# Altium project gps_power.PrjPcb
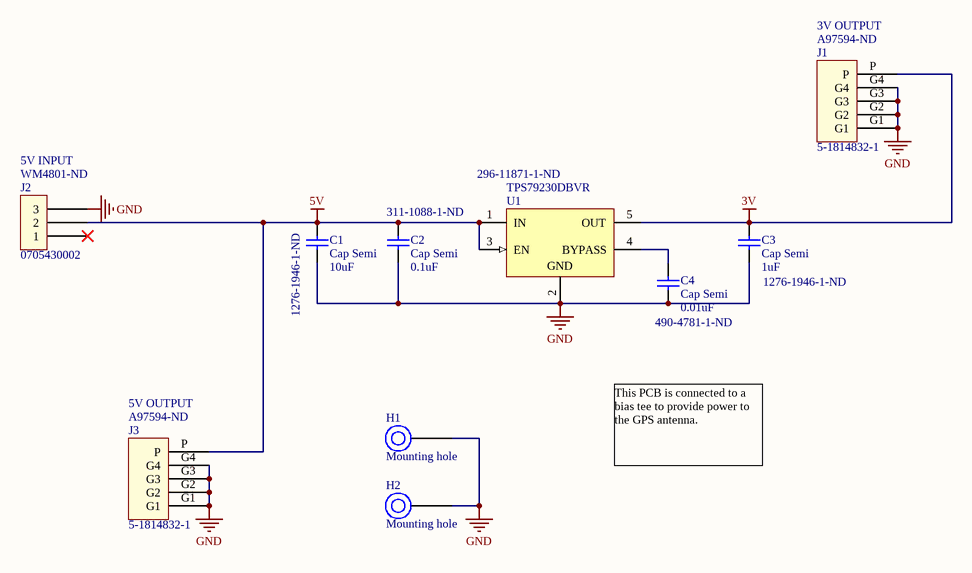
[diagram p0: power-1.SchDoc]
1 sheet, 10 parts. Net scope: global (net labels, ports and power ports of the same name join across sheets).
Board file: gps_power.PcbDoc

## Sheet power-1.SchDoc
size A

### Parts
C1  Cap Semi  value 10uF  Supplier Part Number 1: 1276-1946-1-ND  [1608[0603]]
C2  Cap Semi  value 0.1uF  Supplier Part Number 1: 311-1088-1-ND  [1608[0603]]
C3  Cap Semi  value 1uF  Supplier Part Number 1: 1276-1946-1-ND  [1608[0603]]
C4  Cap Semi  value 0.01uF  Supplier Part Number 1: 490-4781-1-ND  [1608[0603]]
H1  Mounting hole  [M3 hole]  (no BOM)
H2  Mounting hole  [M3 hole]  (no BOM)
J1  5-1814832-1  Supplier Part Number 1: A97594-ND  [5-1814832-1]
J2  0705430002  Supplier Part Number 1: WM4801-ND  [0705430002]
J3  5-1814832-1  Supplier Part Number 1: A97594-ND  [5-1814832-1]
U1  TPS79230DBVR  Supplier Part Number 1: 296-11871-1-ND  [DBV0005A_L]

### Nets
3V: C3.2 J1.P U1.5(OUT)
5V: C1.2 C2.2 J2.2 J3.P U1.1(IN) U1.3(EN)
GND: C1.1 C2.1 C3.1 C4.1 H1.1 H2.1 J1.G1 J1.G2 J1.G3 J1.G4 J2.3 J3.G1 J3.G2 J3.G3 J3.G4 U1.2(GND)
NetC4_2: C4.2 U1.4(BYPASS)

Not connected (* = marked no-connect by the designer): J2 1*

### Notes on the sheet
- (near J1) 3V OUTPUT
- (near J2) 5V INPUT
- (near J3) 5V OUTPUT
- This PCB is connected to a bias tee to provide power to the GPS antenna.

### Library data of the parts
C1 = Cap Semi: Capacitor (Semiconductor SIM Model); Manufacturer: Samsung; Manufacturer Part Number: CL10B105KP8NNNC; Capacitance: 1uF; Tolerance: 10%; Voltage Rating: 10V; Dielectric: X7R; Published: 8-Jun-2000; LatestRevisionDate: 29-May-2009; LatestRevisionNote: IPC-7351 Footprint Added.; PackageReference: C1206; Publisher: Altium Limited; PackageDescription: Chip Capacitor; Supplier 1: Digi-Key; Stock 1: 10370961; RoHS: Yes; Mount: Surface Mount; Case/Package: 0603; Case Code (Metric): 1608; Case Code (Imperial): 0603; Contact Plating: Tin; Min Operating Temperature: -55°C; Max Operating Temperature: 125°C; Package Quantity: 1; Packaging: Tape and Reel; Voltage Rating (DC): 10V; Length: 1.6mm; Height: 0.8mm; Width: 0.031inch; Thickness: 0.035inch; Depth: 0.8mm; Radiation Hardening: No; Lead Free: Lead Free; ComponentLink1URL: https://datasheet.ciiva.com/25788/cl10b105kp8nnnc-25788304.pdf?src-supplier=Digi-Key; ComponentLink1Description: https://datasheet.ciiva.com/25788/cl10b105kp8nnnc-25788304.pdf?src-supplier=Digi-Key; ComponentLink2URL: https://datasheet.ciiva.com/16396/cl10b105kp8nnnc-16396970.pdf?src-supplier=Future+Electronics; ComponentLink2Description: https://datasheet.ciiva.com/16396/cl10b105kp8nnnc-16396970.pdf?src-supplier=Future+Electronics; ComponentLink3URL: https://datasheet.ciiva.com/26838/getdatasheetpartid-358410-26838426.pdf?src-supplier=Verical; ComponentLink3Description: https://datasheet.ciiva.com/26838/getdatasheetpartid-358410-26838426.pdf?src-supplier=Verical
C2 = Cap Semi: Capacitor (Semiconductor SIM Model); Manufacturer: Yageo; Manufacturer Part Number: CC0603KRX7R7BB104; Material: Ceramic; Voltage Rating: 16V; Tolerance: 10%; Capacitance: 100nF; Dielectric: X7R; Insulation Resistance: 100GR; Published: 8-Jun-2000; LatestRevisionDate: 29-May-2009; LatestRevisionNote: IPC-7351 Footprint Added.; PackageReference: C1206; Publisher: Altium Limited; PackageDescription: Chip Capacitor; Supplier 1: Digi-Key; Stock 1: 18235990; RoHS: Yes; Mount: Surface Mount; Case/Package: 0603; Number of Pins: 2; Case Code (Metric): 1608; Case Code (Imperial): 0603; Min Operating Temperature: -55°C; Max Operating Temperature: 125°C; Voltage Rating (DC): 16V; Package Quantity: 1; Packaging: Tape and Reel; Termination: SMD/SMT; Composition: Ceramic; Voltage: 16V; Length: 1.6mm; Height: 0.8mm; Width: 0.031inch; Thickness: 0.035inch; Depth: 0.8mm; Radiation Hardening: No; REACH SVHC: No SVHC; Lead Free: Lead Free; Halogen Free: Halogen Free; ComponentLink1URL: https://datasheet.ciiva.com/144/mlccorderingcode-144182.pdf?src-supplier=Digi-Key; ComponentLink1Description: https://datasheet.ciiva.com/144/mlccorderingcode-144182.pdf?src-supplier=Digi-Key; ComponentLink2URL: https://datasheet.ciiva.com/16625/upy-gphc-x7r-6-3v-to-50v-8-16625526.pdf?src-supplier=Avnet+Europe; ComponentLink2Description: https://datasheet.ciiva.com/16625/upy-gphc-x7r-6-3v-to-50v-8-16625526.pdf?src-supplier=Avnet+Europe; ComponentLink3URL: https://datasheet.ciiva.com/8033/70765-8033799.pdf?src-supplier=Element14; ComponentLink3Description: https://datasheet.ciiva.com/8033/70765-8033799.pdf?src-supplier=Element14; ComponentLink4URL: https://datasheet.ciiva.com/15165/getdatasheetpartid-63554-15165387.pdf?src-supplier=Verical; ComponentLink4Description: https://datasheet.ciiva.com/15165/getdatasheetpartid-63554-15165387.pdf?src-supplier=Verical; ComponentLink5URL: https://datasheet.ciiva.com/7978/1489800-7978141.pdf?src-supplier=Element14; ComponentLink5Description: https://datasheet.ciiva.com/7978/1489800-7978141.pdf?src-supplier=Element14; ComponentLink6URL: https://datasheet.ciiva.com/8033/1734573-8033797.pdf?src-supplier=Element14; ComponentLink6Description: https://datasheet.ciiva.com/8033/1734573-8033797.pdf?src-supplier=Element14; ComponentLink7URL: https://datasheet.ciiva.com/144/mlccorderingcode-144183.pdf?src-supplier=Digi-Key; ComponentLink7Description: https://datasheet.ciiva.com/144/mlccorderingcode-144183.pdf?src-supplier=Digi-Key; ComponentLink8URL: https://datasheet.ciiva.com/144/mlccorderingcode-144184.pdf?src-supplier=Digi-Key; ComponentLink8Description: https://datasheet.ciiva.com/144/mlccorderingcode-144184.pdf?src-supplier=Digi-Key; ComponentLink9URL: https://datasheet.ciiva.com/28450/1489800-28450552.pdf?src-supplier=Element14; ComponentLink9Description: https://datasheet.ciiva.com/28450/1489800-28450552.pdf?src-supplier=Element14; ComponentLink10URL: https://datasheet.ciiva.com/13395/upy-gphc-x7r-6-3v-to-50v-8-13395674.pdf?src-supplier=Mouser; ComponentLink10Description: https://datasheet.ciiva.com/13395/upy-gphc-x7r-6-3v-to-50v-8-13395674.pdf?src-supplier=Mouser; ComponentLink11URL: https://datasheet.ciiva.com/46430/1734573-46430156.pdf?src-supplier=Element14; ComponentLink11Description: https://datasheet.ciiva.com/46430/1734573-46430156.pdf?src-supplier=Element14
C3 = Cap Semi: Capacitor (Semiconductor SIM Model); Manufacturer: Samsung; Manufacturer Part Number: CL10B105KP8NNNC; Tolerance: 10%; Voltage Rating: 10V; Dielectric: X7R; Published: 8-Jun-2000; LatestRevisionDate: 29-May-2009; LatestRevisionNote: IPC-7351 Footprint Added.; PackageReference: C1206; Publisher: Altium Limited; PackageDescription: Chip Capacitor; Supplier 1: Digi-Key; Stock 1: 10370961; RoHS: Yes; Mount: Surface Mount; Case/Package: 0603; Case Code (Metric): 1608; Case Code (Imperial): 0603; Contact Plating: Tin; Min Operating Temperature: -55°C; Max Operating Temperature: 125°C; Package Quantity: 1; Packaging: Tape and Reel; Capacitance: 1uF; Voltage Rating (DC): 10V; Length: 1.6mm; Height: 0.8mm; Width: 0.031inch; Thickness: 0.035inch; Depth: 0.8mm; Radiation Hardening: No; Lead Free: Lead Free; ComponentLink1URL: https://datasheet.ciiva.com/25788/cl10b105kp8nnnc-25788304.pdf?src-supplier=Digi-Key; ComponentLink1Description: https://datasheet.ciiva.com/25788/cl10b105kp8nnnc-25788304.pdf?src-supplier=Digi-Key; ComponentLink2URL: https://datasheet.ciiva.com/16396/cl10b105kp8nnnc-16396970.pdf?src-supplier=Future+Electronics; ComponentLink2Description: https://datasheet.ciiva.com/16396/cl10b105kp8nnnc-16396970.pdf?src-supplier=Future+Electronics; ComponentLink3URL: https://datasheet.ciiva.com/26838/getdatasheetpartid-358410-26838426.pdf?src-supplier=Verical; ComponentLink3Description: https://datasheet.ciiva.com/26838/getdatasheetpartid-358410-26838426.pdf?src-supplier=Verical
C4 = Cap Semi: Capacitor (Semiconductor SIM Model); Manufacturer: Murata; Manufacturer Part Number: GCM188R72A103KA37D; Capacitance: 10nF; Tolerance: 10%; Voltage Rating: 100V; Dielectric: X7R; Published: 8-Jun-2000; LatestRevisionDate: 29-May-2009; LatestRevisionNote: IPC-7351 Footprint Added.; PackageReference: C1206; Publisher: Altium Limited; PackageDescription: Chip Capacitor; Supplier 1: Digi-Key; Stock 1: 9017131; RoHS: Yes; Mount: Surface Mount; Case/Package: 0603; Case Code (Imperial): 0603; Case Code (Metric): 1608; Min Operating Temperature: -55°C; Max Operating Temperature: 125°C; Packaging: Tape and Reel; Voltage Rating (DC): 100V; Package Quantity: 1; Termination: SMD/SMT; Voltage: 100V; Length: 1.6mm; Height: 0.8mm; Width: 0.8mm; Thickness: 0.035inch; Depth: 0.8mm; Ratings: AEC-Q200; Radiation Hardening: No; REACH SVHC: No SVHC; Lead Free: Lead Free; ComponentLink1URL: https://datasheet.ciiva.com/16497/product-16497251.pdf?src-supplier=Future+Electronics; ComponentLink1Description: https://datasheet.ciiva.com/16497/product-16497251.pdf?src-supplier=Future+Electronics; ComponentLink2URL: https://datasheet.ciiva.com/132/product-132907.pdf?src-supplier=Digi-Key; ComponentLink2Description: https://datasheet.ciiva.com/132/product-132907.pdf?src-supplier=Digi-Key; ComponentLink3URL: https://datasheet.ciiva.com/18183/getdatasheetpartid-178890-18183651.pdf?src-supplier=Verical; ComponentLink3Description: https://datasheet.ciiva.com/18183/getdatasheetpartid-178890-18183651.pdf?src-supplier=Verical; ComponentLink4URL: https://datasheet.ciiva.com/132/product-132908.pdf?src-supplier=Digi-Key; ComponentLink4Description: https://datasheet.ciiva.com/132/product-132908.pdf?src-supplier=Digi-Key; ComponentLink5URL: https://datasheet.ciiva.com/11786/0900766b80ef92d0-11786108.pdf?src-supplier=RSComponents; ComponentLink5Description: https://datasheet.ciiva.com/11786/0900766b80ef92d0-11786108.pdf?src-supplier=RSComponents; ComponentLink6URL: https://datasheet.ciiva.com/132/product-132909.pdf?src-supplier=Digi-Key; ComponentLink6Description: https://datasheet.ciiva.com/132/product-132909.pdf?src-supplier=Digi-Key; ComponentLink7URL: https://datasheet.ciiva.com/11619/product-11619719.pdf?src-supplier=Avnet; ComponentLink7Description: https://datasheet.ciiva.com/11619/product-11619719.pdf?src-supplier=Avnet
H1 H2 = Mouting hole
J1 J3 = 5-1814832-1: Manufacturer: TE Connectivity; Body Material: Zinc; Plating: Nickel; Body Plating: Gold; Dielectric Material: PTFE; Impedance: 50R; Frequency: 3GHz; Gender: Female; Connector Type: SMA; Polarity: Normal; Wire/Cable Type: Coaxial; Insulation Resistance: 5GR; Connector System: Cable-to-Board; Number of Positions: 1; Sealable: No (Without); Tail Length: 4mm; Supplier 1: Digi-Key; Manufacturer Part Number: 5-1814832-1; Stock 1: 34232; Pricing 1: 1 = 1.99000, 10 = 1.80400, 25 = 1.69360, 50 = 1.62000, 100 = 1.54640, 250 = 1.39908, 500 = 1.28864, 1000 = 1.10454 (USD); RoHS: Yes; Mount: Through Hole; Case/Package: SMA; Contact Material: Bronze; Contact Plating: Gold; Insulation Material: Polytetrafluoroethylene; Min Operating Temperature: -67°C; Max Operating Temperature: 185°C; Package Quantity: 1; Fastening Type: Threaded; Packaging: Box; Termination: Through Hole; Max Frequency: 3GHz; Orientation: Straight; Length: 0.532inch; Depth: 6.4mm; Radiation Hardening: No; REACH SVHC: No SVHC; Lead Free: Lead Free; ELV: Compliant; ComponentLink1URL: https://datasheet.ciiva.com/642/eng-cd-1814832-b1-642785.pdf?src-supplier=Digi-Key; ComponentLink1Description: https://datasheet.ciiva.com/642/eng-cd-1814832-b1-642785.pdf?src-supplier=Digi-Key; ComponentLink2URL: https://datasheet.ciiva.com/642/eng-cd-1814832-b1-642785.pdf?src-supplier=Avnet; ComponentLink2Description: https://datasheet.ciiva.com/642/eng-cd-1814832-b1-642785.pdf?src-supplier=Avnet; ComponentLink3URL: https://datasheet.ciiva.com/23783/1663582-23783560.pdf?src-supplier=Newark; ComponentLink3Description: https://datasheet.ciiva.com/23783/1663582-23783560.pdf?src-supplier=Newark; ComponentLink4URL: https://datasheet.ciiva.com/16318/5-1814832-1-16318587.pdf?src-supplier=Future+Electronics; ComponentLink4Description: https://datasheet.ciiva.com/16318/5-1814832-1-16318587.pdf?src-supplier=Future+Electronics; ComponentLink5URL: https://datasheet.ciiva.com/11762/0900766b80a70d0f-11762254.pdf?src-supplier=RSComponents; ComponentLink5Description: https://datasheet.ciiva.com/11762/0900766b80a70d0f-11762254.pdf?src-supplier=RSComponents; ComponentLink6URL: https://datasheet.ciiva.com/26824/getdatasheetpartid-396696-26824822.pdf?src-supplier=Verical; ComponentLink6Description: https://datasheet.ciiva.com/26824/getdatasheetpartid-396696-26824822.pdf?src-supplier=Verical; ComponentLink7URL: https://datasheet.ciiva.com/30201/eng-cd-1814832-a-30201302.pdf?src-supplier=Onlinecomponents.com; ComponentLink7Description: https://datasheet.ciiva.com/30201/eng-cd-1814832-a-30201302.pdf?src-supplier=Onlinecomponents.com; ComponentLink8URL: https://datasheet.ciiva.com/25908/eng-cd-1814832-a-25908583.pdf?src-supplier=Avnet+Europe; ComponentLink8Description: https://datasheet.ciiva.com/25908/eng-cd-1814832-a-25908583.pdf?src-supplier=Avnet+Europe; ComponentLink9URL: https://datasheet.ciiva.com/16469/eng-cd-1814832-a-16469256.pdf?src-supplier=Avnet+Asia; ComponentLink9Description: https://datasheet.ciiva.com/16469/eng-cd-1814832-a-16469256.pdf?src-supplier=Avnet+Asia
J2 = 0705430002: Manufacturer: Molex; Manufacturer Part Number: 70543-0002; Number of Positions: 3; Contact Resistance: 30mR; Gender: Male; Current Rating: 3A; Voltage Rating: 250V; Pitch: 2.54mm; Approvals: UL; Glow Wire Compliant: Non-compliant; Supplier 1: Digi-Key; Stock 1: 32342; Pricing 1: 1 = 0.92000, 10 = 0.80500, 100 = 0.69450, 500 = 0.56826, 2496 = 0.45776, 7488 = 0.44198, 12480 = 0.41041 (USD); RoHS: Yes; Mount: Through Hole; Color: Black; Housing Color: Black; Housing Material: Thermoplastic; Contact Material: Bronze; Contact Plating: Gold; Material: Brass; Min Operating Temperature: -40°C; Max Operating Temperature: 105°C; Number of Rows: 1; Packaging: Rail/Tube; Termination: Solder; Orientation: Vertical; Package Quantity: 2496; Number of Contacts: 3; Max Current Rating: 3A; Max Voltage Rating (AC): 250V; Number of Circuits: 3; Voltage Rating (DC): 250V; Length: 10.17mm; Height: 11.81mm; Depth: 6.6mm; Lead Pitch: 2.54mm; Radiation Hardening: No; REACH SVHC: Unknown; ELV: Compliant; Lead Free: Lead Free; Flammability Rating: UL94 V-0; ComponentLink1URL: https://datasheet.ciiva.com/11747/0900766b80d8d64b-11747399.pdf?src-supplier=RSComponents; ComponentLink1Description: https://datasheet.ciiva.com/11747/0900766b80d8d64b-11747399.pdf?src-supplier=RSComponents; ComponentLink2URL: https://datasheet.ciiva.com/30061/97290705430002-pcb-headers-30061900.pdf?src-supplier=Onlinecomponents.com; ComponentLink2Description: https://datasheet.ciiva.com/30061/97290705430002-pcb-headers-30061900.pdf?src-supplier=Onlinecomponents.com; ComponentLink3URL: https://datasheet.ciiva.com/19462/884643-19462365.pdf?src-supplier=Jameco; ComponentLink3Description: https://datasheet.ciiva.com/19462/884643-19462365.pdf?src-supplier=Jameco; ComponentLink4URL: https://datasheet.ciiva.com/5150/0705430002-pcb-headers-172733-5150622.pdf?src-supplier=Mouser; ComponentLink4Description: https://datasheet.ciiva.com/5150/0705430002-pcb-headers-172733-5150622.pdf?src-supplier=Mouser; ComponentLink5URL: https://datasheet.ciiva.com/16657/0705430002-pcb-headers-16657766.pdf?src-supplier=Avnet+Europe; ComponentLink5Description: https://datasheet.ciiva.com/16657/0705430002-pcb-headers-16657766.pdf?src-supplier=Avnet+Europe
U1 = CMP-0394-00276-2: Single Output High PSRR LDO, 100 mA, Fixed 3 V Output, 2.7 to 5.5 V Input, 5-pin SOT-23 (DBV), -40 to 125 degC, Green (RoHS & no Sb/Br); Manufacturer: Texas Instruments; Vin(Max)(V): 5.5; Fixed Output Options(V): 3; SubFamily: Single Channel LDO; Rating: Catalog; Iq(Typ)(mA): 0.2; Accuracy(%): 2; Iout(Max)(A): 0.1; Vdo(Typ)(mV): 55; Vin(Min)(V): 2.7; Number of Outputs: 1; Output Voltage: 3V; Output Current: 100mA; Dropout Voltage: 55mV; Max Power Dissipation: 561mW; Max Input Voltage: 5.5V; Min Input Voltage: 2.7V; Min Current Limit: 285mA; Input Bias Current: 170uA; Polarity: Positive; Quiescent Current: 200uA; Output Voltage Accuracy: 2%; ComponentLink4URL: Samples URL:http://www.ti.com/product/tps79230#samples; Eco-Plan: Green (RoHS & no Sb/Br); ComponentLink3URL: http://www.ti.com/litv/pdf/mpds018i; PackageVersion: 4073253-4/K; PackageReference: DBV0005A; ComponentLink3Description: Package Specification; Code_JEDEC: MO-178; Vout Adj(Min)(V): 3; PackageDescription: 5-Pin Plastic Small Outline, Body 1.60 Ãƒâ€” 2.90 mm, Pitch 0.95 mm; ComponentLink1URL: http://www.ti.com/; Vout Adj(Max)(V): 3; ComponentLink4Description: URL Link1; PartNumber: TPS79230DBVR; ComponentLink1Description: Manufacturer URL; DatasheetVersion: SLVS337B; ComponentLink2Description: Datasheet; Mounting Technology: Surface Mount; ComponentLink2URL: http://www.ti.com/general/docs/lit/getliterature.tsp?genericPartNumber=TPS79230&fileType=pdf; Supplier 1: Digi-Key; Manufacturer Part Number: TPS79230DBVR; Stock 1: 4533; RoHS: Yes; Case/Package: SOT-23; Number of Pins: 5; Min Operating Temperature: -40°C; Max Operating Temperature: 125°C; Packaging: Tape and Reel; Package Quantity: 1; Max Output Current: 100mA; Nominal Output Voltage: 3V; Number of Regulators: 1; Power Dissipation: 561mW; Min Output Voltage: 3V; Accuracy: 2%; Max Output Voltage: 3V; Output Type: Fixed; Radiation Hardening: No; REACH SVHC: No SVHC; Lead Free: Lead Free; ComponentLink5URL: https://datasheet.ciiva.com/22700/1887683-22700166.pdf?src-supplier=Element14; ComponentLink5Description: https://datasheet.ciiva.com/22700/1887683-22700166.pdf?src-supplier=Element14